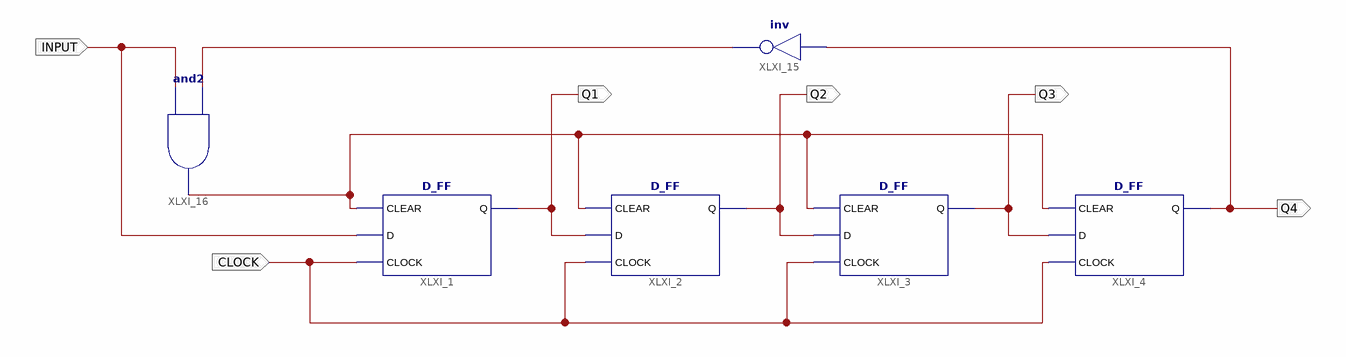
[diagram p0: schematic sheet 1]
// Xilinx ISE schematic Practice.sch (artix7) as structural Verilog: 6 symbols, 6 ports
module Practice (
  input  CLOCK,
  input  INPUT,
  output Q1,
  output Q2,
  output Q3,
  output Q4
);

  wire CLR, XLXN_30;

  D_FF XLXI_1 (.CLEAR(CLR), .CLOCK(CLOCK), .D(INPUT), .Q(Q1));
  D_FF XLXI_2 (.CLEAR(CLR), .CLOCK(CLOCK), .D(Q1), .Q(Q2));
  D_FF XLXI_3 (.CLEAR(CLR), .CLOCK(CLOCK), .D(Q2), .Q(Q3));
  D_FF XLXI_4 (.CLEAR(CLR), .CLOCK(CLOCK), .D(Q3), .Q(Q4));
  not XLXI_15 (XLXN_30, Q4);
  and XLXI_16 (CLR, INPUT, XLXN_30);
endmodule
